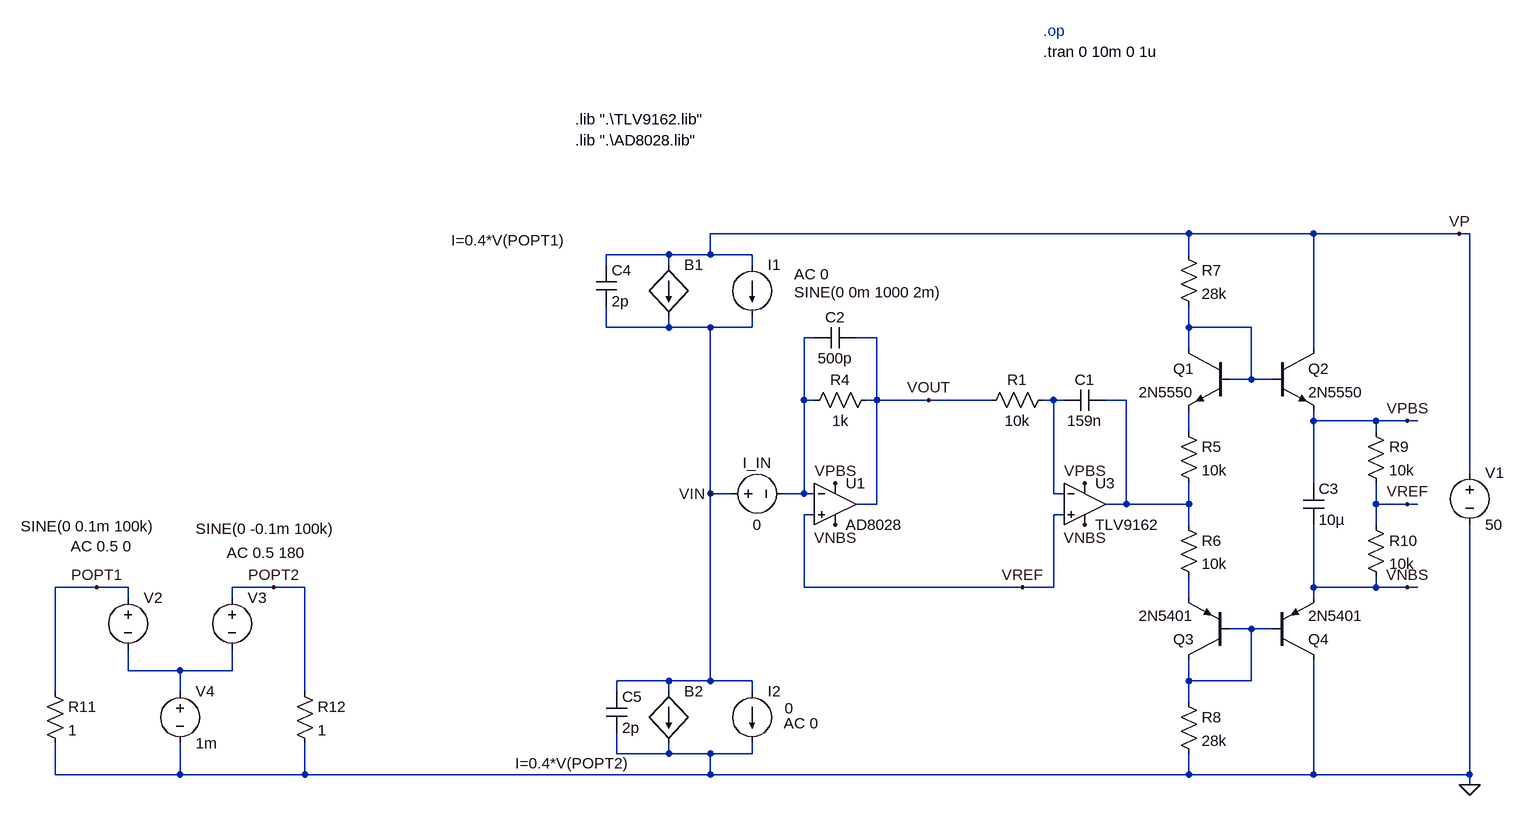
[diagram p0: schematic bootstrapping.asc]
bootstrapping.asc, the LTspice schematic file:
Version 4
SHEET 1 1864 1656
WIRE 928 -48 192 -48
WIRE 1120 -48 928 -48
WIRE 1344 -48 1120 -48
WIRE 1360 -48 1344 -48
WIRE 128 -16 32 -16
WIRE 192 -16 192 -48
WIRE 192 -16 128 -16
WIRE 256 -16 192 -16
WIRE 928 -16 928 -48
WIRE 32 0 32 -16
WIRE 128 0 128 -16
WIRE 256 0 256 -16
WIRE 32 96 32 64
WIRE 128 96 128 80
WIRE 128 96 32 96
WIRE 192 96 128 96
WIRE 256 96 256 80
WIRE 256 96 192 96
WIRE 928 96 928 64
WIRE 1024 96 928 96
WIRE 352 112 336 112
WIRE 448 112 416 112
WIRE 928 128 928 96
WIRE 1120 128 1120 -48
WIRE 1024 176 1024 96
WIRE 1024 176 992 176
WIRE 1056 176 1024 176
WIRE 336 208 336 112
WIRE 352 208 336 208
WIRE 448 208 448 112
WIRE 448 208 432 208
WIRE 528 208 448 208
WIRE 624 208 528 208
WIRE 720 208 704 208
WIRE 736 208 720 208
WIRE 832 208 800 208
WIRE 1120 240 1120 224
WIRE 1216 240 1120 240
WIRE 1264 240 1216 240
WIRE 1280 240 1264 240
WIRE 928 256 928 224
WIRE 1216 256 1216 240
WIRE 1360 320 1360 -48
WIRE 1120 336 1120 240
WIRE 192 352 192 96
WIRE 224 352 192 352
WIRE 336 352 336 208
WIRE 336 352 304 352
WIRE 352 352 336 352
WIRE 720 352 720 208
WIRE 736 352 720 352
WIRE 448 368 448 208
WIRE 448 368 416 368
WIRE 832 368 832 208
WIRE 832 368 800 368
WIRE 928 368 928 336
WIRE 928 368 832 368
WIRE 1216 368 1216 336
WIRE 1264 368 1216 368
WIRE 1280 368 1264 368
WIRE 352 384 336 384
WIRE 736 384 720 384
WIRE 928 400 928 368
WIRE 1216 400 1216 368
WIRE -752 496 -816 496
WIRE -704 496 -752 496
WIRE -480 496 -544 496
WIRE -432 496 -480 496
WIRE 336 496 336 384
WIRE 672 496 336 496
WIRE 720 496 720 384
WIRE 720 496 672 496
WIRE 1120 496 1120 400
WIRE 1216 496 1216 480
WIRE 1216 496 1120 496
WIRE 1264 496 1216 496
WIRE 1280 496 1264 496
WIRE -704 512 -704 496
WIRE -544 512 -544 496
WIRE 928 512 928 480
WIRE 1120 512 1120 496
WIRE 1024 560 992 560
WIRE 1056 560 1024 560
WIRE -704 624 -704 592
WIRE -624 624 -704 624
WIRE -544 624 -544 592
WIRE -544 624 -624 624
WIRE 128 640 48 640
WIRE 192 640 192 352
WIRE 192 640 128 640
WIRE 256 640 192 640
WIRE 928 640 928 608
WIRE 1024 640 1024 560
WIRE 1024 640 928 640
WIRE -816 656 -816 496
WIRE -624 656 -624 624
WIRE -432 656 -432 496
WIRE 48 656 48 640
WIRE 128 656 128 640
WIRE 256 656 256 640
WIRE 928 672 928 640
WIRE 48 752 48 720
WIRE 128 752 128 736
WIRE 128 752 48 752
WIRE 192 752 128 752
WIRE 256 752 256 736
WIRE 256 752 192 752
WIRE -816 784 -816 736
WIRE -624 784 -624 736
WIRE -624 784 -816 784
WIRE -432 784 -432 736
WIRE -432 784 -624 784
WIRE 192 784 192 752
WIRE 192 784 -432 784
WIRE 928 784 928 752
WIRE 928 784 192 784
WIRE 1120 784 1120 608
WIRE 1120 784 928 784
WIRE 1360 784 1360 400
WIRE 1360 784 1120 784
WIRE 1360 800 1360 784
FLAG 384 336 VPBS
FLAG 768 336 VPBS
FLAG 384 400 VNBS
FLAG 768 400 VNBS
FLAG 1264 368 VREF
FLAG 672 496 VREF
FLAG 1264 240 VPBS
FLAG 1264 496 VNBS
FLAG 1344 -48 VP
FLAG 1360 800 0
FLAG -752 496 POPT1
FLAG -480 496 POPT2
FLAG 528 208 VOUT
FLAG 192 352 VIN
SYMBOL opamp2 384 304 R0
SYMATTR InstName U1
SYMATTR Value AD8028
SYMBOL opamp2 768 304 R0
SYMATTR InstName U3
SYMATTR Value TLV9162
SYMBOL voltage 1360 304 R0
SYMATTR InstName V1
SYMATTR Value 50
SYMBOL npn 992 128 M0
SYMATTR InstName Q1
SYMATTR Value 2N5550
SYMBOL npn 1056 128 R0
SYMATTR InstName Q2
SYMATTR Value 2N5550
SYMBOL pnp 992 608 R180
SYMATTR InstName Q3
SYMATTR Value 2N5401
SYMBOL pnp 1056 608 M180
SYMATTR InstName Q4
SYMATTR Value 2N5401
SYMBOL cap 800 192 R90
WINDOW 0 0 32 VBottom 2
WINDOW 3 32 32 VTop 2
SYMATTR InstName C1
SYMATTR Value 159n
SYMBOL res 720 192 R90
WINDOW 0 0 56 VBottom 2
WINDOW 3 32 56 VTop 2
SYMATTR InstName R1
SYMATTR Value 10k
SYMBOL res 448 192 R90
WINDOW 0 0 56 VBottom 2
WINDOW 3 32 56 VTop 2
SYMATTR InstName R4
SYMATTR Value 1k
SYMBOL cap 416 96 R90
WINDOW 0 0 32 VBottom 2
WINDOW 3 32 32 VTop 2
SYMATTR InstName C2
SYMATTR Value 500p
SYMBOL res 912 240 R0
SYMATTR InstName R5
SYMATTR Value 10k
SYMBOL res 912 384 R0
SYMATTR InstName R6
SYMATTR Value 10k
SYMBOL res 912 -32 R0
SYMATTR InstName R7
SYMATTR Value 28k
SYMBOL res 912 656 R0
SYMATTR InstName R8
SYMATTR Value 28k
SYMBOL res 1200 240 R0
SYMATTR InstName R9
SYMATTR Value 10k
SYMBOL res 1200 384 R0
SYMATTR InstName R10
SYMATTR Value 10k
SYMBOL cap 1104 336 R0
SYMATTR InstName C3
SYMATTR Value 10µ
SYMBOL voltage -704 496 R0
WINDOW 123 -88 -63 Left 2
WINDOW 39 0 0 Left 0
WINDOW 3 -165 -94 Left 2
SYMATTR Value2 AC 0.5 0
SYMATTR Value SINE(0 0.1m 100k)
SYMATTR InstName V2
SYMBOL res -832 640 R0
SYMATTR InstName R11
SYMATTR Value 1
SYMBOL voltage -544 496 R0
WINDOW 123 -8 -53 Left 2
WINDOW 39 0 0 Left 0
WINDOW 3 -56 -90 Left 2
SYMATTR Value2 AC 0.5 180
SYMATTR Value SINE(0 -0.1m 100k)
SYMATTR InstName V3
SYMBOL res -448 640 R0
SYMATTR InstName R12
SYMATTR Value 1
SYMBOL bi 128 0 R0
WINDOW 3 -335 -38 Left 2
SYMATTR Value I=0.4*V(POPT1)
SYMATTR InstName B1
SYMBOL bi 128 656 R0
WINDOW 3 -236 111 Left 2
SYMATTR Value I=0.4*V(POPT2)
SYMATTR InstName B2
SYMBOL current 256 0 R0
WINDOW 3 65 42 Left 2
WINDOW 123 65 14 Left 2
WINDOW 39 0 0 Left 0
SYMATTR Value SINE(0 0m 1000 2m)
SYMATTR Value2 AC 0
SYMATTR InstName I1
SYMBOL current 256 656 R0
WINDOW 123 49 49 Left 2
WINDOW 39 0 0 Left 0
WINDOW 3 50 26 Left 2
SYMATTR Value2 AC 0
SYMATTR Value 0
SYMATTR InstName I2
SYMBOL voltage -624 640 R0
WINDOW 123 0 0 Left 0
WINDOW 39 0 0 Left 0
SYMATTR InstName V4
SYMATTR Value 1m
SYMBOL voltage 208 352 R270
WINDOW 0 32 56 VTop 2
WINDOW 3 -32 56 VBottom 2
WINDOW 123 0 0 Left 0
WINDOW 39 0 0 Left 0
SYMATTR InstName I_IN
SYMATTR Value 0
SYMBOL cap 16 0 R0
SYMATTR InstName C4
SYMATTR Value 2p
SYMBOL cap 32 656 R0
SYMATTR InstName C5
SYMATTR Value 2p
TEXT -16 -224 Left 2 !.lib ".\\TLV9162.lib"
TEXT 704 -360 Left 2 ;.op
TEXT 704 -328 Left 2 !.tran 0 10m 0 1u
TEXT -16 -192 Left 2 !.lib ".\\AD8028.lib"

The netlist it stands for:
* bootstrapping.asc
XU1 VREF N002 VPBS VNBS VOUT AD8028  ; pins In+ In- V+ V- OUT
XU3 VREF N003 VPBS VNBS N004 TLV9162  ; pins In+ In- V+ V- OUT
V1 VP 0 50
Q1 N001 N001 N005 0 2N5550
Q2 VP N001 VPBS 0 2N5550
Q3 N007 N007 N006 0 2N5401
Q4 0 N007 VNBS 0 2N5401
C1 N004 N003 159n
R1 N003 VOUT 10k
R4 VOUT N002 1k
C2 VOUT N002 500p
R5 N005 N004 10k
R6 N004 N006 10k
R7 VP N001 28k
R8 N007 0 28k
R9 VPBS VREF 10k
R10 VREF VNBS 10k
C3 VPBS VNBS 10µ
V2 POPT1 N008 SINE(0 0.1m 100k) AC 0.5 0
R11 POPT1 0 1
V3 POPT2 N008 SINE(0 -0.1m 100k) AC 0.5 180
R12 POPT2 0 1
B1 VP VIN I=0.4*V(POPT1)
B2 VIN 0 I=0.4*V(POPT2)
I1 VP VIN SINE(0 0m 1000 2m) AC 0
I2 VIN 0 0 AC 0
V4 N008 0 1m
V§I_IN VIN N002 0
C4 VP VIN 2p
C5 VIN 0 2p
.model NPN NPN
.model PNP PNP
.lib standard.bjt
.lib ".\TLV9162.lib"
* .op
.tran 0 10m 0 1u
.lib ".\AD8028.lib"
.backanno
.end